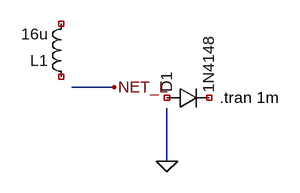
[diagram p0: schematic case_02.asc]
case_02.asc, the LTspice schematic file:
Version 4.1
SHEET 1 880 680
WIRE 480 144 544 144
WIRE 624 176 624 256
FLAG 544 144 NET_L
FLAG 624 256 0
SYMBOL ind 480 144 R180
SYMATTR InstName L1
SYMATTR Value 16u
SYMATTR Type ind
SYMBOL diode 624 176 R270
SYMATTR InstName D1
SYMATTR Value 1N4148
SYMATTR SpiceLine Ron=0.2
TEXT 704 160 Left 2 !.tran 1m

The netlist it stands for:
* case_02.asc
L1 NC_01 NC_02 16u
D1 NC_03 NC_04 1N4148 Ron=0.2
.model D D
.lib standard.dio
.tran 1m
.backanno
.end